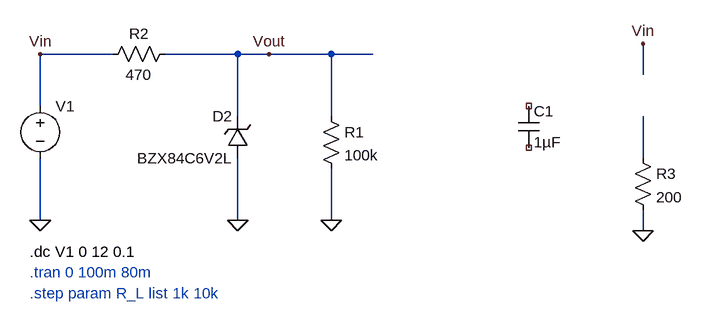
[diagram p0: schematic lab1part4.asc]
lab1part4.asc, the LTspice schematic file:
Version 4
SHEET 1 1096 680
WIRE 176 48 64 48
WIRE 368 48 256 48
WIRE 416 48 368 48
WIRE 512 48 416 48
WIRE 576 48 512 48
WIRE 992 80 992 32
WIRE 64 128 64 48
WIRE 368 144 368 48
WIRE 512 144 512 48
WIRE 992 208 992 144
WIRE 64 304 64 208
WIRE 368 304 368 208
WIRE 512 304 512 224
WIRE 992 320 992 288
FLAG 64 304 0
FLAG 64 48 Vin
FLAG 368 304 0
FLAG 992 32 Vin
FLAG 992 320 0
FLAG 416 48 Vout
FLAG 512 304 0
SYMBOL voltage 64 112 R0
WINDOW 123 0 0 Left 0
WINDOW 39 0 0 Left 0
SYMATTR InstName V1
SYMATTR Value ""
SYMBOL res 272 32 R90
WINDOW 0 0 56 VBottom 2
WINDOW 3 32 56 VTop 2
SYMATTR InstName R2
SYMATTR Value 470
SYMBOL res 976 192 R0
SYMATTR InstName R3
SYMATTR Value 200
SYMBOL zener 384 208 R180
WINDOW 0 24 64 Left 2
WINDOW 3 24 0 Left 2
SYMATTR InstName D2
SYMATTR Value BZX84C6V2L
SYMATTR Description Diode
SYMATTR Type diode
SYMBOL cap 800 128 R0
SYMATTR InstName C1
SYMATTR Value 1µF
SYMBOL res 496 128 R0
SYMATTR InstName R1
SYMATTR Value 100k
TEXT 48 352 Left 2 !.dc V1 0 12 0.1
TEXT 48 384 Left 2 ;.tran 0 100m 80m
TEXT 48 416 Left 2 ;.step param R_L list 1k 10k

The netlist it stands for:
* lab1part4.asc
V1 Vin 0
R2 Vout Vin 470
R3 N001 0 200
D2 0 Vout BZX84C6V2L
C1 NC_01 NC_02 1µF
R1 Vout 0 100k
.model D D
.lib standard.dio
.dc V1 0 12 0.1
* .tran 0 100m 80m
* .step param R_L list 1k 10k
.backanno
.end